# Altium schematic sheet parent.SchDoc
size A4
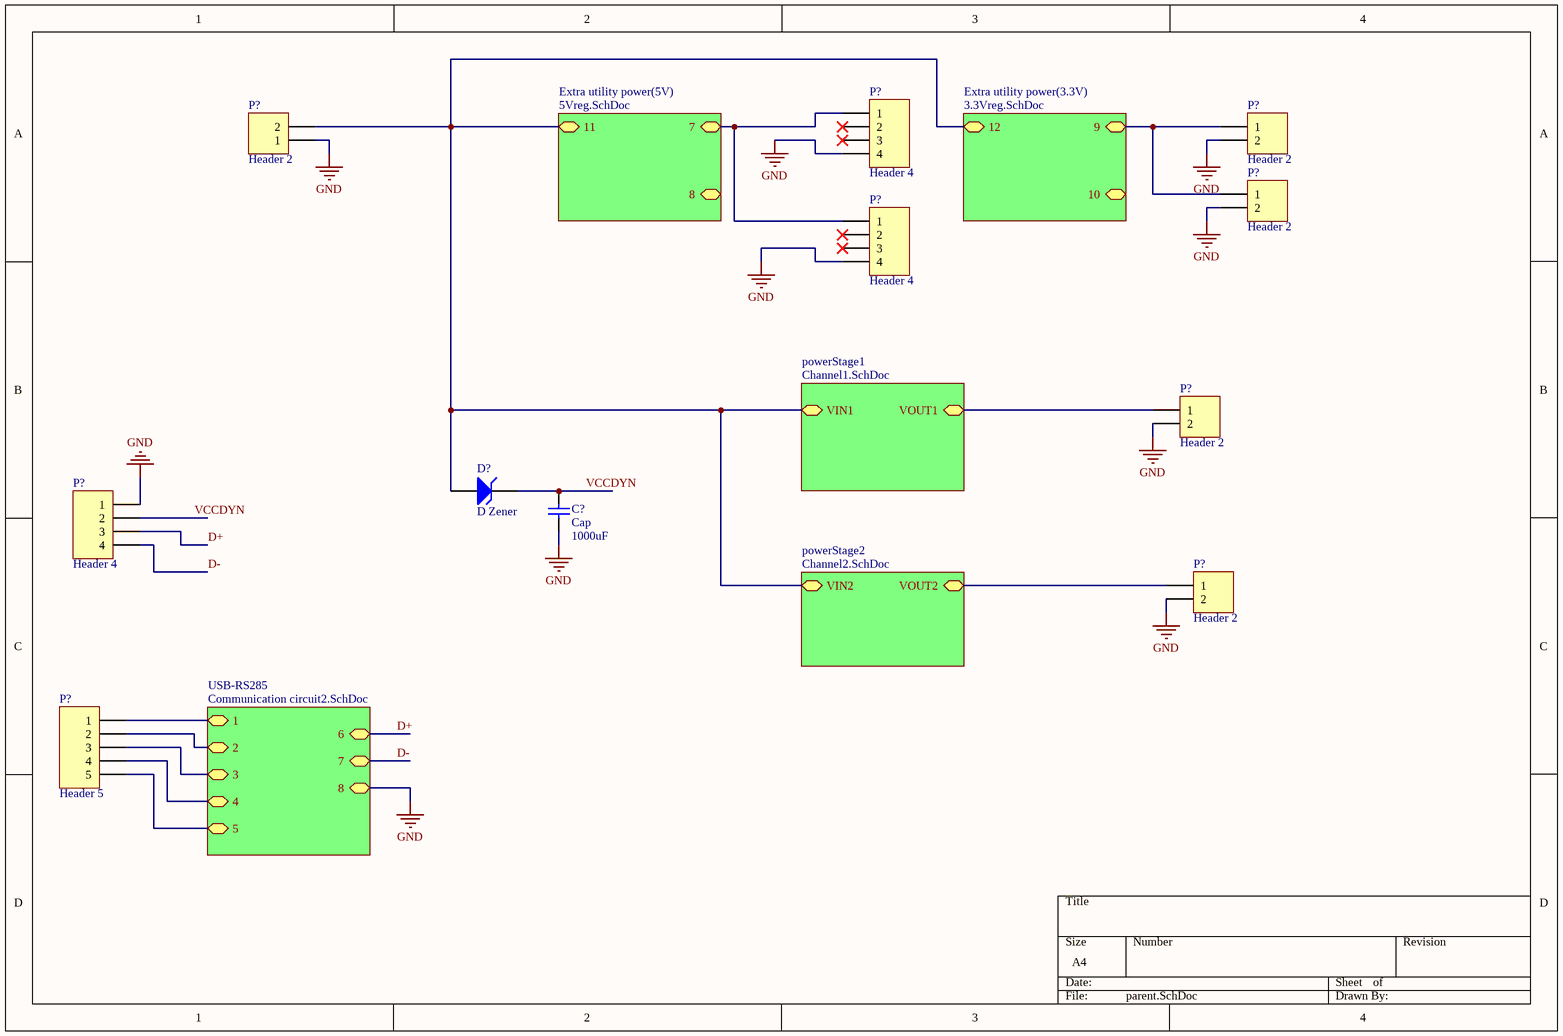
[diagram p0: parent.SchDoc]

## Parts
(Parts that share a designator on the sheet are numbered #1, #2 ... from top to bottom, then left to right.)
C?  Cap  value 1000uF  [1608[0603]]
D?  D Zener  [SMB]
P?#1  Header 4  [A-USB-A/SMT]
P?#2  Header 2  [HDR1X2]
P?#3  Header 2  [HDR1X2]
P?#4  Header 2  [HDR1X2]
P?#5  Header 4  [A-USB-A/SMT]
P?#6  Header 2  [HDR1X2]
P?#7  Header 4  [HDR1X4]
P?#8  Header 2  [HDR1X2]
P?#9  Header 5  [481900001]

## Sub-sheets
Extra utility power(3.3V) = 3.3Vreg.SchDoc: 9, 10, 12
Extra utility power(5V) = 5Vreg.SchDoc: 7, 8, 11
powerStage1 = Channel1.SchDoc: VIN1, VOUT1
powerStage2 = Channel2.SchDoc: VIN2, VOUT2
USB-RS285 = Communication circuit2.SchDoc: 1, 2, 3, 4, 6, 7, 8, 5

## Nets
GND: C?.2 P?#1.4 P?#2.2 P?#3.1 P?#4.2 P?#5.4 P?#6.2 P?#7.1 P?#8.2 ; sheet USB-RS285/8
D+: P?#7.3 ; sheet USB-RS285/6
D-: P?#7.4 ; sheet USB-RS285/7
VCCDYN: C?.1 D?.2(K) P?#7.2
NetD?_1: D?.1(A) P?#3.2 ; sheet powerStage1/VIN1, sheet powerStage2/VIN2, sheet Extra utility power(5V)/11, sheet Extra utility power(3.3V)/12
NetP?#1_1: P?#1.1 P?#5.1 ; sheet Extra utility power(5V)/7
NetP?#2_1: P?#2.1 P?#4.1 ; sheet Extra utility power(3.3V)/9
NetP?#6_1: P?#6.1 ; sheet powerStage1/VOUT1
NetP?#8_1: P?#8.1 ; sheet powerStage2/VOUT2
NetP?#9_1: P?#9.1 ; sheet USB-RS285/1
NetP?#9_2: P?#9.2 ; sheet USB-RS285/2
NetP?#9_3: P?#9.3 ; sheet USB-RS285/3
NetP?#9_4: P?#9.4 ; sheet USB-RS285/4
NetP?#9_5: P?#9.5 ; sheet USB-RS285/5

Not connected (* = marked no-connect by the designer): P?#1 2* 3*; P?#5 2* 3*

## Library data of the parts
C? = Cap: Capacitor; Published: 8-Jun-2000; LatestRevisionDate: 17-Jul-2002; LatestRevisionNote: Re-released for DXP Platform.; PackageReference: RAD-0.3; Publisher: Altium Limited; PackageDescription: Radial Cap, Thru-Hole; 2 Leads; 0.3 in Pin Spacing
D? = D Zener: Zener Diode; Published: 8-Jun-2000; LatestRevisionDate: 17-Jul-2002; LatestRevisionNote: Re-released for DXP Platform.; PackageReference: DIODE-0.7; Publisher: Altium Limited; PackageDescription: Diode, Thru-Hole; 2 Leads; 0.7 in Pin Spacing
P?#1 P?#5 P?#7 = Header 4: Header, 4-Pin; LatestRevisionDate: 17-Jul-2002; LatestRevisionNote: Re-released for DXP Platform.; Publisher: Altium Limited
P?#2-P?#4 P?#6 P?#8 = Header 2: Header, 2-Pin; LatestRevisionDate: 17-Jul-2002; LatestRevisionNote: Re-released for DXP Platform.; Publisher: Altium Limited
P?#9 = Header 5: Header, 5-Pin; LatestRevisionDate: 17-Jul-2002; LatestRevisionNote: Re-released for DXP Platform.; Publisher: Altium Limited